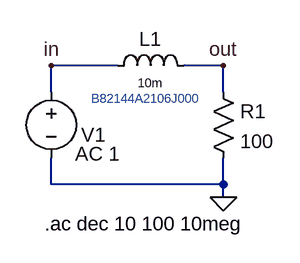
[diagram p0: schematic 06-indutor_LPF_B82144A2106J000.asc]
06-indutor_LPF_B82144A2106J000.asc, the LTspice schematic file:
Version 4
SHEET 1 880 680
WIRE 16 48 -64 48
WIRE 144 48 96 48
WIRE -64 80 -64 48
WIRE 144 80 144 48
WIRE -64 192 -64 160
WIRE 144 192 144 160
WIRE 144 192 -64 192
WIRE 144 208 144 192
FLAG 144 208 0
FLAG 144 48 out
FLAG -64 48 in
SYMBOL res 128 64 R0
SYMATTR InstName R1
SYMATTR Value 100
SYMBOL voltage -64 64 R0
WINDOW 123 29 91 Left 2
WINDOW 39 0 0 Left 0
WINDOW 0 36 68 Left 2
SYMATTR Value2 AC 1
SYMATTR InstName V1
SYMATTR Value ""
SYMBOL ind 0 64 R270
WINDOW 0 32 56 VTop 2
WINDOW 3 5 56 VBottom 1
SYMATTR InstName L1
SYMATTR Value 10m
SYMATTR SpiceLine Rser=42 Cpar=3p
TEXT -72 240 Left 2 !.ac dec 10 100 10meg
TEXT -16 88 Left 1 ;B82144A2106J000

The netlist it stands for:
* 06-indutor_LPF_B82144A2106J000.asc
R1 out 0 100
V1 in 0 AC 1
L1 in out 10m Rser=42 Cpar=3p
.ac dec 10 100 10meg
* B82144A2106J000
.backanno
.end

* Results of the author's LTspice run, read from the files saved beside the schematic
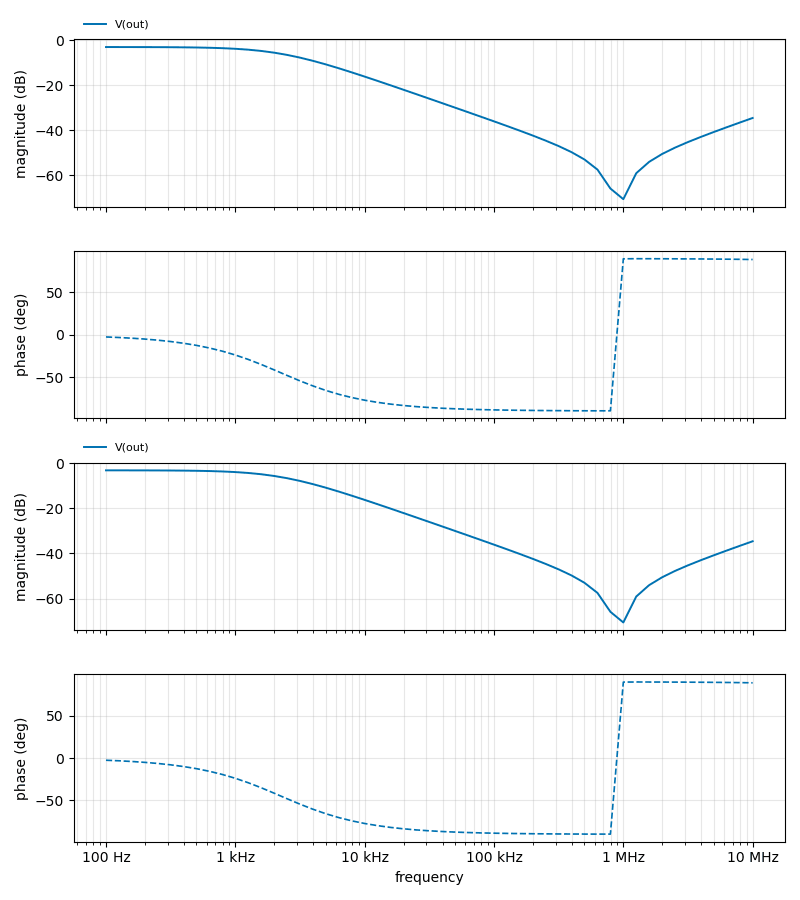
[diagram p1: AC Analysis of 06-indutor_LPF_B82144A2106J000.asc, plotted from the saved traces]
* AC Analysis, 1 run:
*   V(out): -3.05 dB at 100 Hz, -34.57 dB at 10 MHz, peak -3.05 dB at 100 Hz, 3 dB below the peak at 2.249 kHz
*   V(out): -3.05 dB at 100 Hz, -34.57 dB at 10 MHz, peak -3.05 dB at 100 Hz, 3 dB below the peak at 2.249 kHz